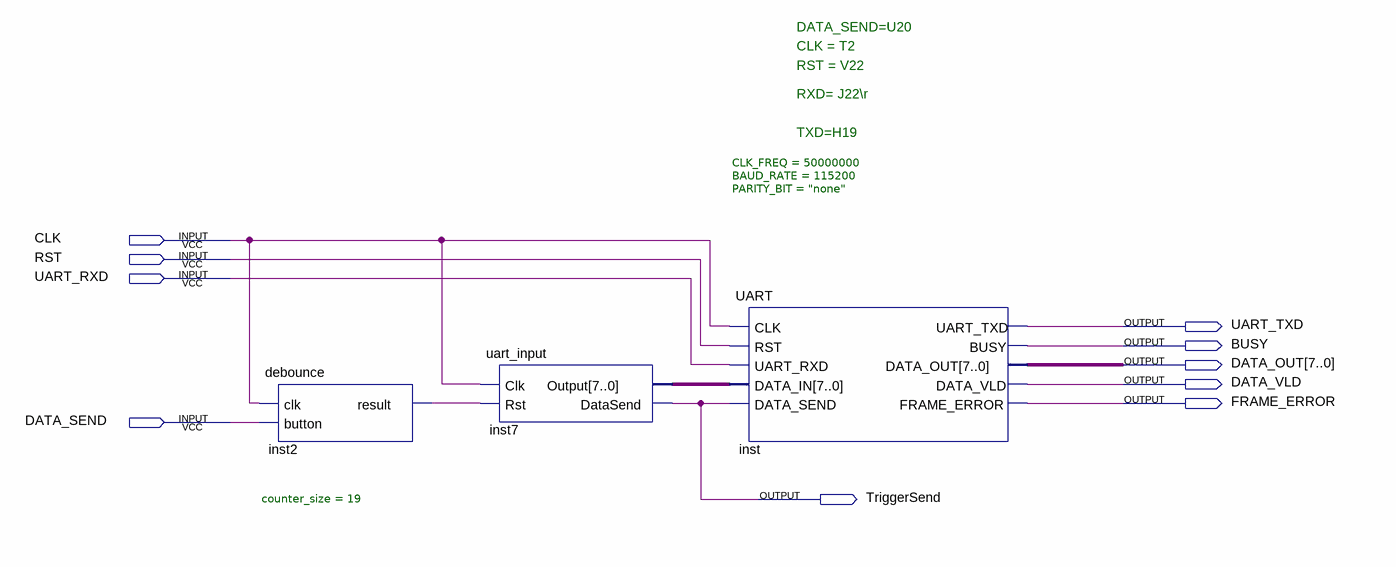
[diagram p0: schematic sheet]
// Quartus schematic simple_uart_for_fpga.bdf as structural Verilog: 3 symbols, 10 pins
module simple_uart_for_fpga (
  input  CLK,
  input  RST,
  input  UART_RXD,
  input  DATA_SEND,
  output UART_TXD,
  output BUSY,
  output [7:0] DATA_OUT,
  output DATA_VLD,
  output FRAME_ERROR,
  output TriggerSend
);

  wire inst2_result;
  wire [7:0] inst7_output;

  debounce #(.counter_size(19)) inst2 (.clk(CLK), .button(DATA_SEND), .result(inst2_result));
  uart_input inst7 (.Clk(CLK), .Rst(inst2_result), .Output(inst7_output), .DataSend(TriggerSend));
  UART #(.CLK_FREQ(50000000), .BAUD_RATE(115200), .PARITY_BIT("none")) inst (
    .CLK(CLK), .RST(RST), .UART_RXD(UART_RXD), .DATA_IN(inst7_output), .DATA_SEND(TriggerSend),
    .UART_TXD(UART_TXD), .BUSY(BUSY), .DATA_OUT(DATA_OUT), .DATA_VLD(DATA_VLD), .FRAME_ERROR(FRAME_ERROR));

  // Notes on the sheet:
  //   DATA_SEND=U20
  //   CLK = T2
  //   RST = V22
  //   RXD= J22\r
  //   TXD=H19
endmodule
